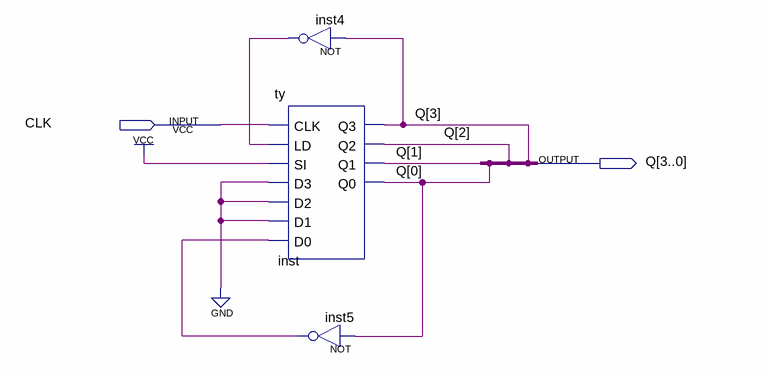
[diagram p0: schematic sheet]
// Quartus schematic alineab.bdf as structural Verilog: 3 symbols, 2 pins
module alineab (
  input  CLK,
  output [3:0] Q
);

  wire inst4_out, inst5_out;

  not inst4 (inst4_out, Q[3]);
  ty inst (
    .CLK(CLK), .LD(inst4_out), .SI(1'b1), .D3(1'b0), .D2(1'b0), .D1(1'b0), .D0(inst5_out), .Q3(Q[3]),
    .Q2(Q[2]), .Q1(Q[1]), .Q0(Q[0]));
  not inst5 (inst5_out, Q[0]);
endmodule
